# EAGLE design Rariot (EAGLE 6.5.0)
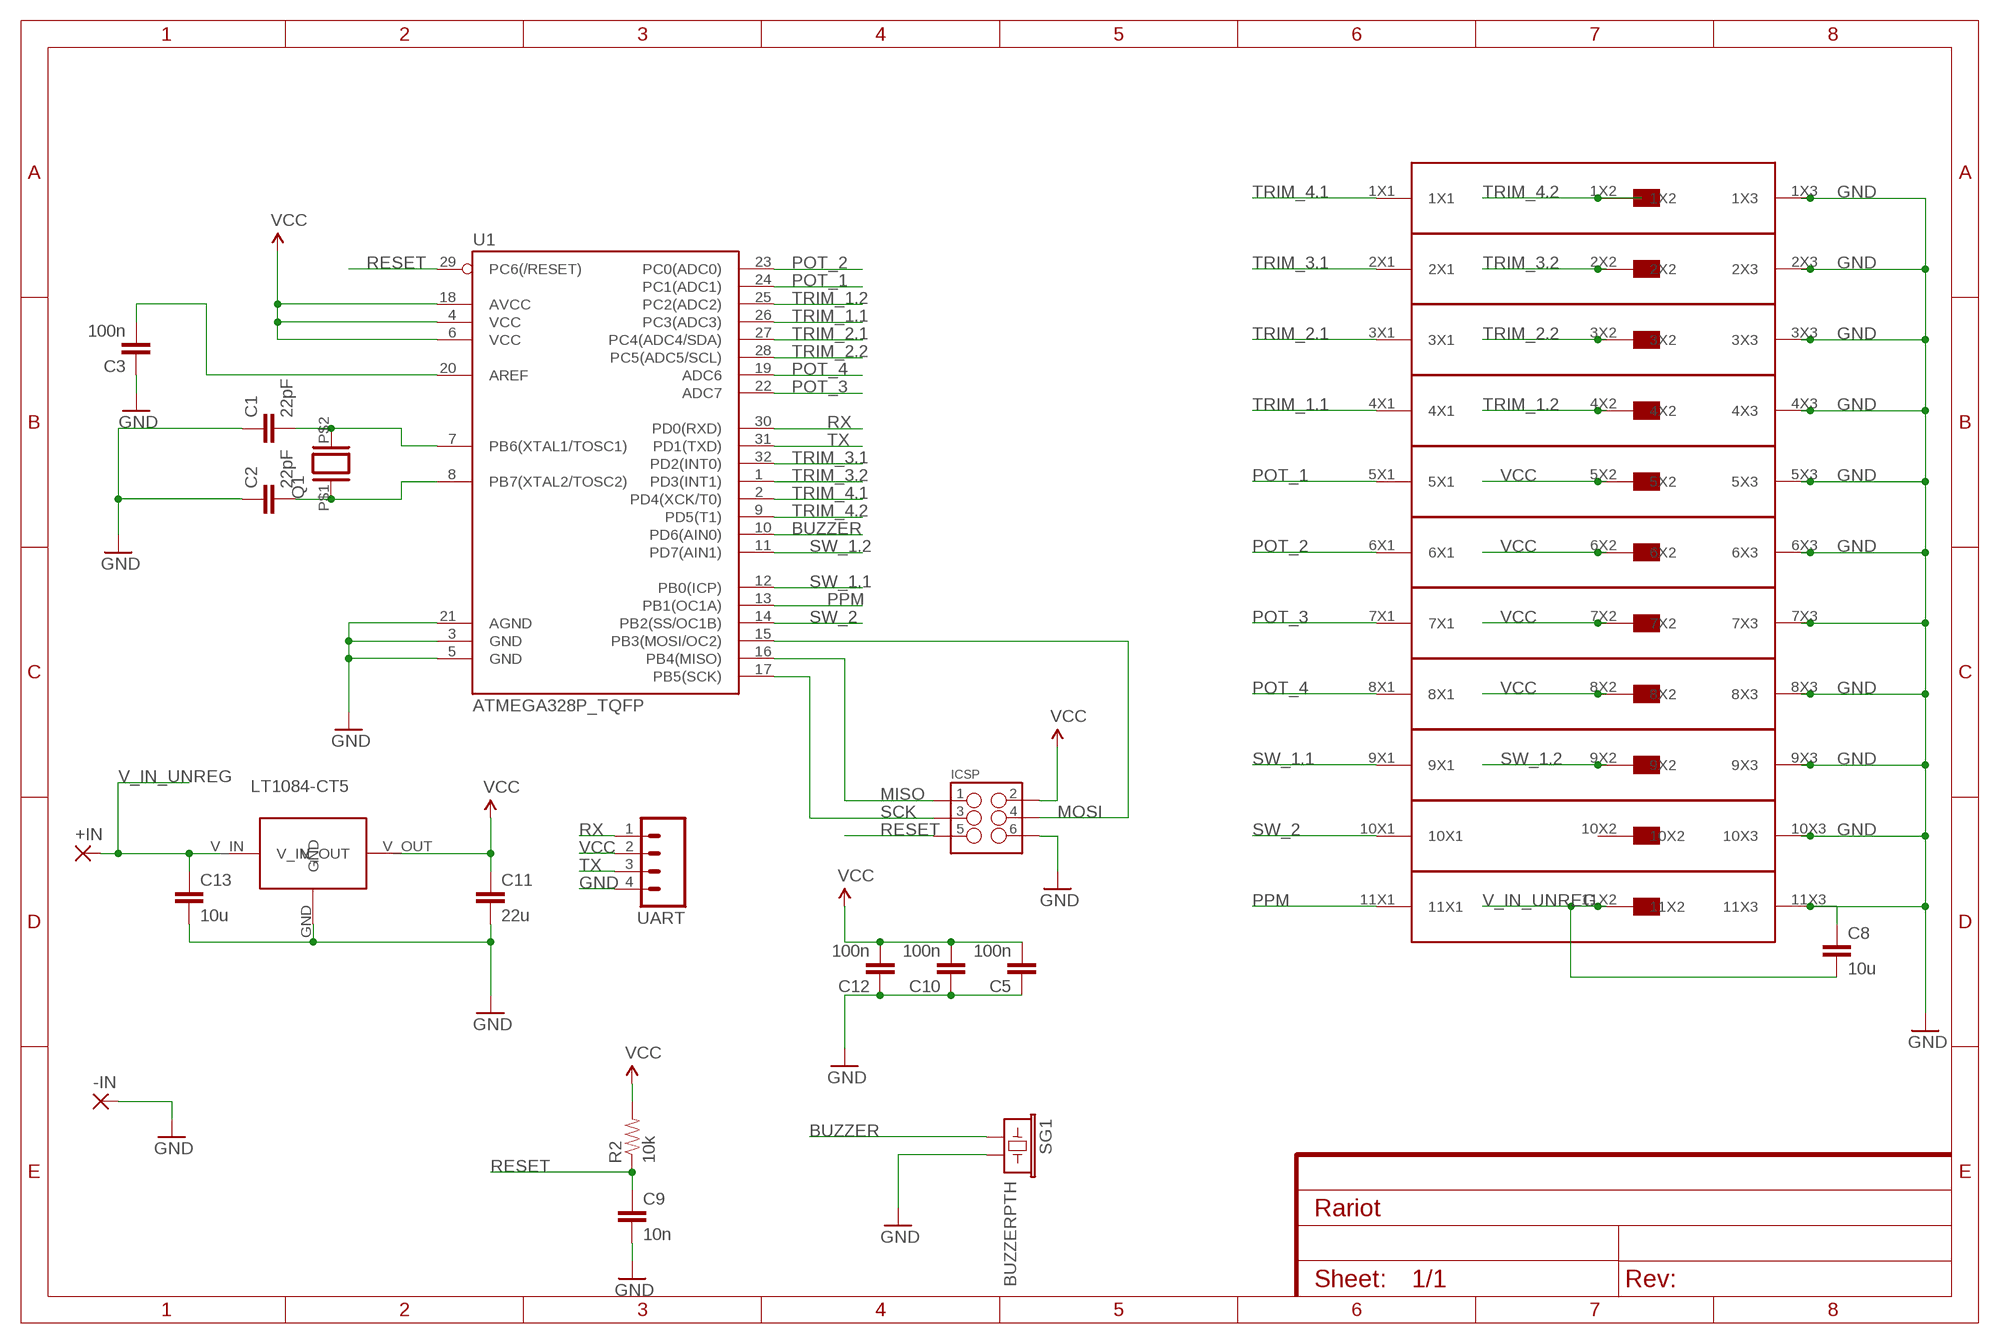
[diagram p0: schematic, sheet 1]

## Parts
+IN  SMD5  [SMD2,54-5,08]
-IN  SMD5  [SMD2,54-5,08]
C1  22pF  CAP0805  [0805]
C2  22pF  CAP0805  [0805]
C3  100n  CAP0805  [0805]
C5  100n  CAP0805  [0805]
C8  10u  CAP1206  [1206]
C9  10n  CAP0805  [0805]
C10  100n  CAP0805  [0805]
C11  22u  CAP1206  [1206]
C12  100n  CAP0805  [0805]
C13  10u  CAP1206  [1206]
ICSP  FEMALE 2x3  M03X2FEMALE  [2X3]
Q1  XTAL/SSMD  [X-TAL_SMD]
R2  10k  RESISTOR0805-RES  [0805]
SG1  BUZZERPTH  [BUZZER-12MM]
U1  ATMEGA328P_TQFP  [TQFP32-08]
U$1  11X3_2.54_PIN_HEADER  [11X3_2,54_PIN_HEADER]
U$2  LT1084-CT5  [TO-220]
UART  M04PTH  [1X04]

## Nets
BUZZER: SG1.+ U1.10(PD6(AIN0))
GND: -IN.1(P) C1.1 C2.1 C3.1 C5.1 C8.1 C9.2 C10.1 C11.2 C12.1 C13.2 ICSP.6 SG1.- U1.3(GND) U1.5(GND) U1.21(AGND) U$1.1X3 U$1.2X3 U$1.3X3 U$1.4X3 U$1.5X3 U$1.6X3 U$1.7X3 U$1.8X3 U$1.9X3 U$1.10X3 U$1.11X3 U$2.GND UART.4
MISO: ICSP.1 U1.16(PB4(MISO))
MOSI: ICSP.4 U1.15(PB3(MOSI/OC2))
N$2: C1.2 Q1.P$2 U1.7(PB6(XTAL1/TOSC1))
N$3: C3.2 U1.20(AREF)
N$4: C2.2 Q1.P$1 U1.8(PB7(XTAL2/TOSC2))
POT_1: U1.24(PC1(ADC1)) U$1.5X1
POT_2: U1.23(PC0(ADC0)) U$1.6X1
POT_3: U1.22(ADC7) U$1.7X1
POT_4: U1.19(ADC6) U$1.8X1
PPM: U1.13(PB1(OC1A)) U$1.11X1
RESET: C9.1 ICSP.5 R2.1 U1.29(PC6(/RESET))
RX: U1.30(PD0(RXD)) UART.1
SCK: ICSP.3 U1.17(PB5(SCK))
SW_1.1: U1.12(PB0(ICP)) U$1.9X1
SW_1.2: U1.11(PD7(AIN1)) U$1.9X2
SW_2: U1.14(PB2(SS/OC1B)) U$1.10X1
TRIM_1.1: U1.26(PC3(ADC3)) U$1.4X1
TRIM_1.2: U1.25(PC2(ADC2)) U$1.4X2
TRIM_2.1: U1.27(PC4(ADC4/SDA)) U$1.3X1
TRIM_2.2: U1.28(PC5(ADC5/SCL)) U$1.3X2
TRIM_3.1: U1.32(PD2(INT0)) U$1.2X1
TRIM_3.2: U1.1(PD3(INT1)) U$1.2X2
TRIM_4.1: U1.2(PD4(XCK/T0)) U$1.1X1
TRIM_4.2: U1.9(PD5(T1)) U$1.1X2
TX: U1.31(PD1(TXD)) UART.3
V_IN_UNREG: +IN.1(P) C8.2 C13.1 U$1.11X2 U$2.V_IN
VCC: C5.2 C10.2 C11.1 C12.2 ICSP.2 R2.2 U1.4(VCC) U1.6(VCC) U1.18(AVCC) U$1.5X2 U$1.6X2 U$1.7X2 U$1.8X2 U$2.V_OUT UART.2
Unconnected: U$1.10X2

## Library data of the parts
+IN -IN = wirepad:SMD5: SMD PAD
C1-C3 C5 C8-C13 = SparkFun-Capacitors:CAP: Capacitor Standard 0603 ceramic capacitor, and 0.1" leaded capacitor.
ICSP = SparkFun-Connectors:M03X2: 2x3 .1" header. Shrouded, with keying- CONN-10681 SMT- CONN-11415 Pogo pins- HW-11044; PROD_ID: CONN-11566
Q1 = Oma_kirjasto:XTAL/S: CRYSTAL
R2 = SparkFun-Resistors:RESISTOR: Resistor Basic schematic elements and footprints for 0603, 1206, and PTH resistors.
SG1 = SparkFun-Electromechanical:BUZZER: Buzzer 12mm Spark Fun Electronics SKU : Comp-Buzzer
U1 = SparkFun-DigitalIC:ATMEGA328P_TQFP; PROD_ID: IC-09069
U$1 = Oma_kirjasto:11X3_2.54_PIN_HEADER
U$2 = Oma_kirjasto:LT1084-CT5
UART = SparkFun-Connectors:M04: Header 4 Standard 4-pin 0.1" header. Use with straight break away headers (SKU : PRT-00116), right angle break away headers (PRT-00553), swiss pins (PRT-00743), machine pins (PRT-00117), and female headers (PRT-00115). Molex polarized connector foot print use with SKU : PRT-08231 with associated crimp pins and housings. 1MM SMD Version SKU: PRT-10208

## Net classes
0 default: width 0.457 mm, drill 0.406 mm, clearance 0.254 mm

## Board
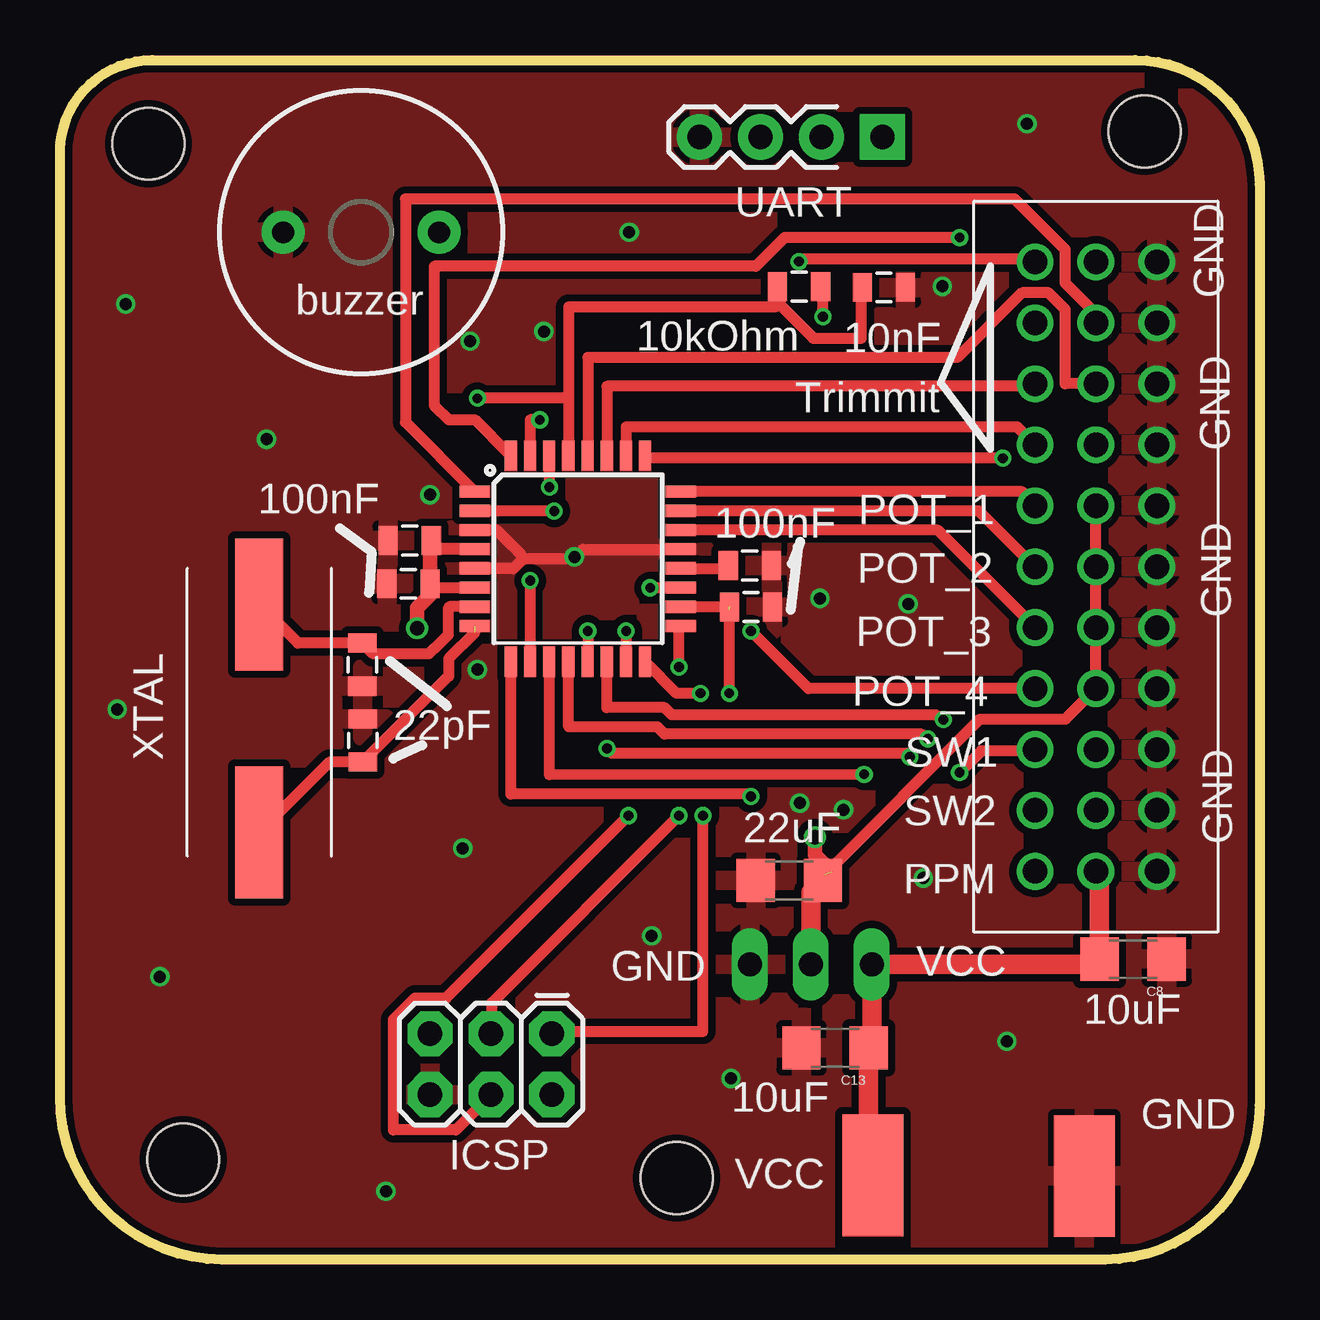
[diagram p1: board, top side]
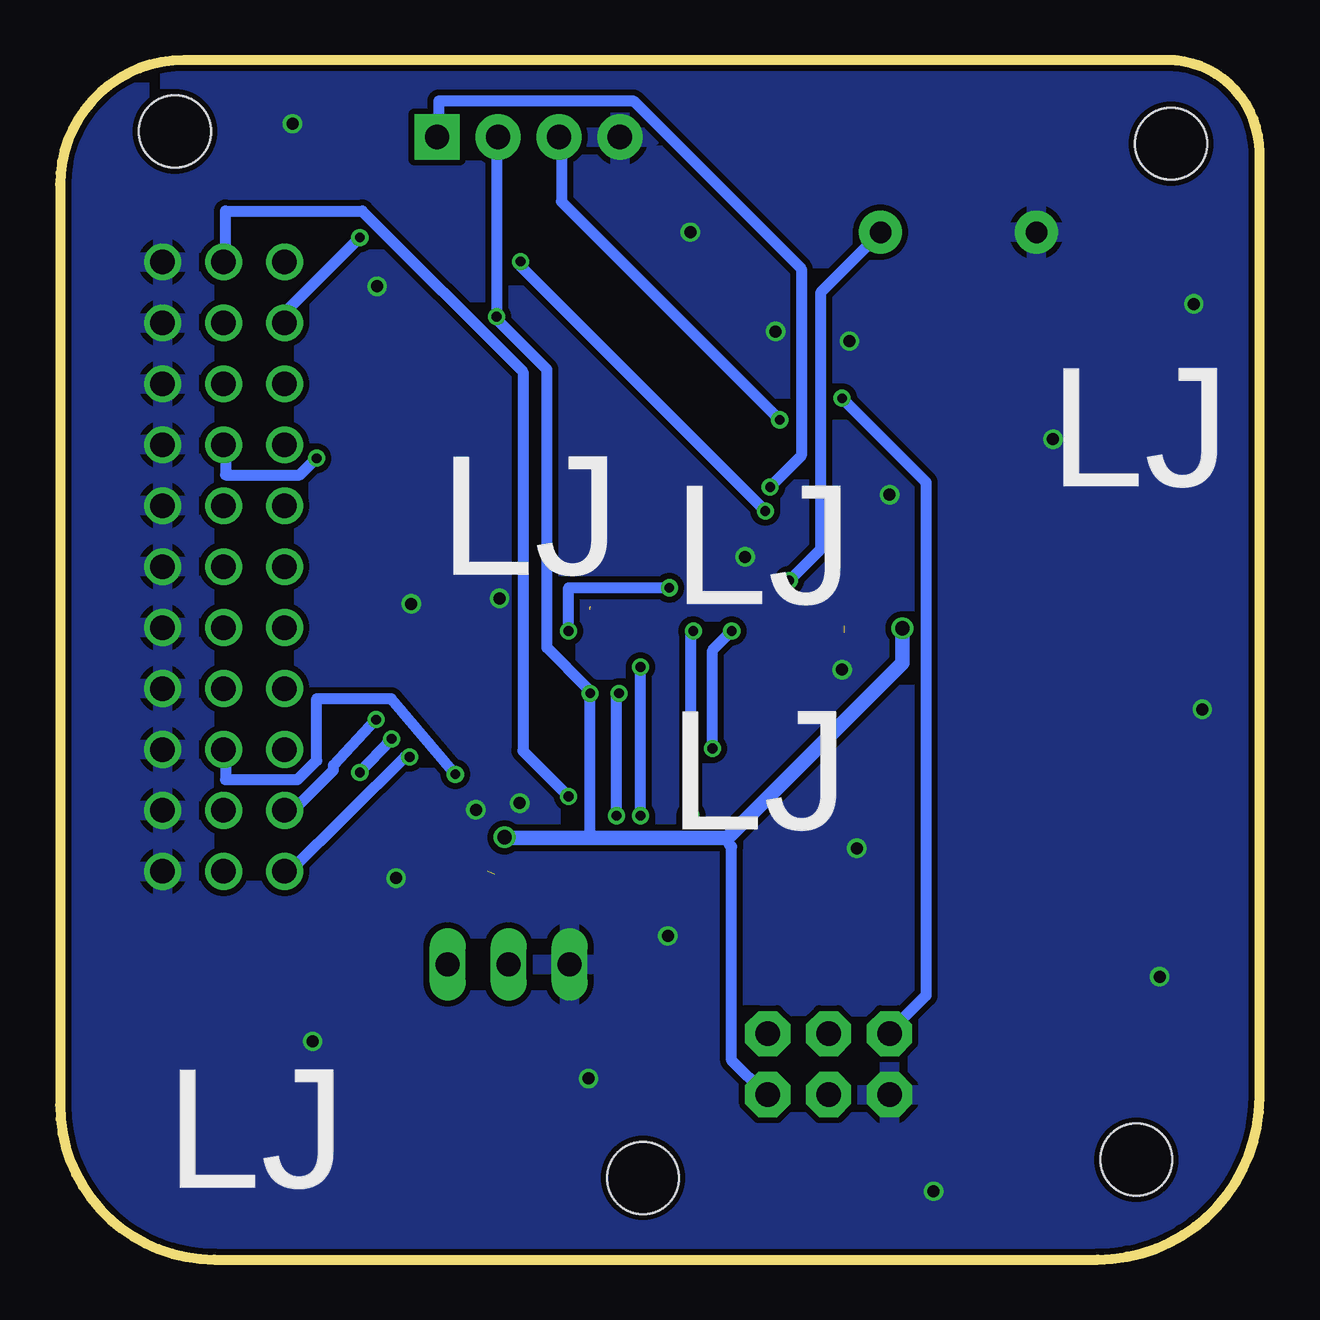
[diagram p2: board, bottom side, seen from below]

Size 50 x 50 mm. Coordinates in mm from the lower left corner, seen from the top.
Outline: 50,44.82 50,6.44 arc-90 43.56,0 6.76,0 arc-90 0,6.76 0,46.15 arc-90 3.85,50 44.82,50 arc-90 50,44.82
Copper layers (1*16): Top 0.035mm / dielectric 1.5mm / Bottom 0.035mm
Design rules "dirt_cheap_dirty_boards.v1": minimum track width 5mil, minimum drill 12mil, track to track 5mil, track to pad 5mil, pad to pad 5mil, via to via 5mil, smd to smd 0mil, copper to edge 10mil, drill to drill 10mil, minimum pad ring 10mil, minimum via ring 6mil, stop-mask expansion 2mil, vias tented up to drill 25mil, thermal gap 10mil
Holes 3 mm at 3.68,46.51 45.2,47.02 5.13,4.16 25.7,3.4

### Footprints (pad centres in the part's own frame; a part is rotated, then mirrored left to right if it is on the bottom)
SMD2,54-5,08 = smd 2.54 x 5.08: 1 0,0
0805 = smd 0.8 x 1.2: 1 -0.9,0; 2 0.9,0
1206 = smd 1.6 x 1.8: 1 -1.4,0; 2 1.4,0
2X3 = drill 1.016 pad 1.88 octagon: 1 0,0; 2 0,2.54; 3 2.54,0; 4 2.54,2.54; 5 5.08,0; 6 5.08,2.54
X-TAL_SMD = smd 5.5 x 2: P$1 0,0; P$2 9.5,0
BUZZER-12MM = drill 0.9 pad 1.778: + 3.25,0; - -3.25,0
TQFP32-08 = smd 1.27 x 0.508: 1 -4.293,2.8; 2 -4.293,2; 3 -4.293,1.2; 4 -4.293,0.4; 5 -4.293,-0.4; 6 -4.293,-1.2; 7 -4.293,-2; 8 -4.293,-2.8; 17 4.293,-2.8; 18 4.293,-2; 19 4.293,-1.2; 20 4.293,-0.4; 21 4.293,0.4; 22 4.293,1.2; 23 4.293,2; 24 4.293,2.8 | smd 0.508 x 1.27: 9 -2.8,-4.293; 10 -2,-4.293; 11 -1.2,-4.293; 12 -0.4,-4.293; 13 0.4,-4.293; 14 1.2,-4.293; 15 2,-4.293; 16 2.8,-4.293; 25 2.8,4.293; 26 2,4.293; 27 1.2,4.293; 28 0.4,4.293; 29 -0.4,4.293; 30 -1.2,4.293; 31 -2,4.293; 32 -2.8,4.293
11X3_2,54_PIN_HEADER = drill 1.02: 1X1 0,0; 1X2 2.54,0; 1X3 5.08,0; 2X1 0,-2.54; 2X2 2.54,-2.54; 2X3 5.08,-2.54; 3X1 0,-5.08; 3X2 2.54,-5.08; 3X3 5.08,-5.08; 4X1 0,-7.62; 4X2 2.54,-7.62; 4X3 5.08,-7.62; 5X1 0,-10.16; 5X2 2.54,-10.16; 5X3 5.08,-10.16; 6X1 0,-12.7; 6X2 2.54,-12.7; 6X3 5.08,-12.7; 7X1 0,-15.24; 7X2 2.54,-15.24; 7X3 5.08,-15.24; 8X1 0,-17.78; 8X2 2.54,-17.78; 8X3 5.08,-17.78; 9X1 0,-20.32; 9X2 2.54,-20.32; 9X3 5.08,-20.32; 10X1 0,-22.86; 10X2 2.54,-22.86; 10X3 5.08,-22.86; 11X1 0,-25.4; 11X2 2.54,-25.4; 11X3 5.08,-25.4
TO-220 = drill 1 long: GND -2.54,0; V_IN 2.54,0; V_OUT 0,0
1X04 = drill 1.016 pad 1.88 square: 1 0,0 | drill 1.016 pad 1.88: 2 2.54,0; 3 5.08,0; 4 7.62,0

### Placement (x,y rotation side)
+IN  33.89,3.51 0 top
-IN  42.7,3.48 0 top
C1  12.6,24.8 90 top
C2  12.62,21.64 270 top
C3  28.75,28.93 180 top
C5  14.58,29.97 0 top
C8  44.73,12.52 180 top
C9  34.34,40.52 0 top
C10  14.53,28.17 0 top
C11  30.4,15.8 180 top
C12  28.8,27.2 180 top
C13  32.31,8.82 180 top
ICSP  20.5,9.41 180 top
Q1  8.31,17.81 90 top
R2  30.81,40.55 0 top
SG1  12.55,42.82 0 top
U1  21.59,29.21 0 top
U$1  40.64,41.58 0 top
U$2  31.3,12.3 0 top
UART  34.28,46.79 180 top

### Tracks (layer width: path | path; a pad name or v marks a point on that pad's centre or on a via)
BUZZER  (via drill 0.41)
  Top 0.457: v19.6,28.3 19.6,25 U1.10
  Bottom 0.457: v19.6,28.3 18.3,29.6 18.3,40.3 15.8,42.8 SG1.+
GND  (via drill 0.5 pad 0.3)
  Top 0.457: 19.3,29.2 18.9,28.8 U1.5 | 19.3,29.2 21.4,29.2 v21.44,29.29 21.6,29.4 21.8,29.6 25.8,29.6 U1.21 | U1.3 18.2,30.4 19.2,29.4 19.3,29.2
  other vias: 2.74,39.83 4.17,11.79 13.59,2.84 31.67,27.56 39.47,9.09 36.78,40.56 23.72,42.82 35.99,15.9 24.66,13.49 16.79,17.14 2.39,22.94 8.61,34.19 20.17,38.68 17.09,38.28 27.97,7.54 15.42,31.88 17.4,24.59 40.31,47.35 30.84,19.02 32.66,18.75 35.36,27.33
  pour Top (isolate 0.305): 50,44.98 50,6.46 arc-90 43.54,0 6.82,0 arc-90 0,6.82 0,45.68 arc-90 4.32,50 44.98,50 arc-90
  pour Bottom: 50,45.07 50,6.4 arc-90 43.6,0 6.85,0 arc-90 0,6.85 0,46.26 arc-90 3.74,50 45.07,50 arc-90
MISO  (via drill 0.41)
  Top 0.457: v26.7,23.6 25.7,23.6 24.4,24.9 U1.16 | v26.8,18.5 26.8,9.5 20.6,9.5 ICSP.1
  Bottom 0.457: v26.7,23.6 26.8,23.5 v26.8,18.5
MOSI  (via drill 0.41)
  Top 0.457: v23.6,26.2 23.6,25 U1.15 | v23.7,18.5 16.1,10.9 14.8,10.9 13.9,10 13.9,5.4 16.5,5.4 17.9,6.8 ICSP.4
  Bottom 0.457: v23.6,26.2 23.7,26.1 v23.7,18.5
N$2
  Top 0.457: 12.88,25.43 C1.2 | C1.2 9.92,25.7 Q1.P$2 | U1.7 16.24,27.21 16.18,27.15 16.18,26.04 15.62,25.48 15.6,25.48 15.37,25.25 13.05,25.25 C1.2 | 12.82,25.48 C1.2
N$3
  Top 0.457: U1.20 27.73,28.81 C3.2
N$4  (1 unrouted)
  Top 0.457: 17.3,26.14 16.2,25.04 16.2,24.32 C2.2 11.23,20.74 Q1.P$1
POT_1
  Top 0.457: U1.24 25.9,32 40.1,32 40.6,31.5 U$1.5X1
POT_2
  Top 0.457: U1.23 25.9,31.2 38.3,31.2 40.6,28.9 U$1.6X1
POT_3
  Top 0.457: U1.22 25.9,30.4 36.6,30.4 40.6,26.4 U$1.7X1
POT_4  (via drill 0.41)
  Top 0.457: v24.6,28 25.8,28 U1.19 | v28.8,26.2 31.2,23.8 40.6,23.8 U$1.8X1
  Bottom 0.457: v24.6,28 28.8,28 v28.8,26.2
PPM  (via drill 0.41)
  Top 0.457: v22,26.2 22,25 U1.13 | v22.8,21.3 23,21.1 35.3,21.1 v35.42,20.95
  Bottom 0.457: v22,26.2 22.8,25.4 v22.8,21.3 | v35.42,20.95 35.62,20.95 40.4,16.2 40.6,16.2 U$1.11X1
RESET  (via drill 0.41)
  Top 0.457: 30,39.8 31.4,38.4 33.4,38.4 33.4,40.5 C9.1 | 30,39.8 30,40.5 R2.1 | 21.2,35.9 21.2,39.7 29.8,39.7 30,39.8 | 21.2,35.9 21.2,33.6 U1.29 | 21.2,35.9 v17.4,35.9
  Bottom 0.457: v17.4,35.9 13.9,32.4 13.9,11 15.4,9.5 ICSP.5
RX  (via drill 0.41)
  Top 0.457: v20.4,32.2 U1.30
  Bottom 0.457: v20.4,32.2 19.1,33.5 19.1,41.3 26.1,48.3 34.2,48.3 34.2,46.8 UART.1
SCK  (via drill 0.41)
  Top 0.457: v25.8,24.7 25.8,26.4 U1.17 | v25.8,18.5 18,10.7 18,9.5 ICSP.3
  Bottom 0.457: v25.8,18.5 v25.8,24.7
SW_1.1  (via drill 0.41)
  Top 0.457: v36.17,21.7 35.9,21.9 25.2,21.9 24.9,22.2 21.2,22.2 21.2,24.9 U1.12 | v37.5,20.3 38.4,21.2 40.6,21.2 U$1.9X1
  Bottom 0.457: v37.5,20.3 v36.17,21.7
SW_1.2  (via drill 0.41)
  Top 0.457: v33.52,20.23 20.4,20.2 20.4,24.9 U1.11
  Bottom 0.457: v33.52,20.23 36.19,23.38 39.3,23.38 39.3,20.8 40.1,20 43.1,20 43.1,21.2 U$1.9X2
SW_2  (via drill 0.41)
  Top 0.457: v36.82,22.5 36.5,22.7 25.5,22.7 25.2,23 22.8,23 22.8,24.9 U1.14
  Bottom 0.457: v36.82,22.5 38.6,20.6 38.6,20.4 40.2,18.8 40.6,18.8 U$1.10X1
TRIM_1.1
  Top 0.457: U1.26 23.6,33.6 23.6,34.7 39.9,34.7 40.6,34 U$1.4X1
TRIM_1.2  (via drill 0.41)
  Top 0.457: v39.3,33.4 24.5,33.4 U1.25
  Bottom 0.457: v39.3,33.4 40,32.7 43.1,32.7 43.1,33.9 U$1.4X2
TRIM_2.1
  Top 0.457: U1.27 22.8,33.6 22.8,36.4 40.6,36.4 U$1.3X1
TRIM_2.2
  Top 0.457: U1.28 22,33.6 22,37.6 37.4,37.6 40.1,40.3 41.2,40.3 41.9,39.6 41.9,36.5 43.1,36.5 U$1.3X2
TRIM_3.1  (via drill 0.41)
  Top 0.457: v37.5,42.6 30.2,42.6 29,41.4 15.6,41.4 15.6,35.6 16.2,35 17.3,35 18.7,33.6 U1.32
  Bottom 0.457: v37.5,42.6 40.6,39.5 40.6,39.1 U$1.2X1
TRIM_3.2
  Top 0.457: U1.1 17.2,32.1 14.4,34.9 14.4,44.2 39.8,44.2 41.9,42.1 41.9,40.7 43.1,39.5 43.1,39.1 U$1.2X2
TRIM_4.1  (via drill 0.41)
  Top 0.457: v20.6,31.2 U1.2 | v30.8,41.6 30.9,41.7 40.5,41.7 40.6,41.6 U$1.1X1
  Bottom 0.457: v20.6,31.2 30.8,41.4 v30.8,41.6
TRIM_4.2  (via drill 0.41)
  Top 0.457: v28.8,19.3 28.7,19.4 18.8,19.4 18.8,24.9 U1.9
  Bottom 0.457: v28.8,19.3 30.7,21.2 30.7,37 37.4,43.7 43.1,43.7 43.1,41.6 U$1.1X2
TX  (via drill 0.41)
  Top 0.457: v20,35 19.6,35 19.6,33.6 U1.31
  Bottom 0.457: v20,35 29.1,44.1 29.1,46.7 UART.3
V_IN_UNREG
  Top 0.813: U$1.11X2 43.33,16.03 C8.2 43.11,12.3 U$2.V_IN 33.84,8.96 C13.1 33.71,3.69 +IN.1
VCC  (via drill 0.41, 0.6)  (3 unrouted)
  Top 0.457: v31.8,39.3 31.8,40.5 R2.2 | U1.6 17.2,28 15.7,28 C10.2 | v27.9,23.6 27.9,27.1 | C11.1 31.8,15.82 31.88,15.82 31.88,16.05 38.35,22.53 41.91,22.53 U$1.8X2 U$1.7X2 U$1.6X2 U$1.5X2 | U1.18 C12.2
  Top 0.508: U1.4 15.84,29.61 C5.2
  Top 0.61: C5.2 15.48,29.61 15.43,29.61 C10.2 15.43,28.01 15.44,28.01 15.44,27.71 14.88,27.15 v14.88,26.31 | v31.47,17.6 31.47,16.87 32.17,16.17
  Top 0.813: U$2.V_OUT 31.3,15.3 C11.1
  Bottom 0.457: UART.2 31.8,46.7 v31.8,39.3 31.7,39.1 29.7,37.1 29.7,25.5 28,23.8 v27.9,23.6 27.9,17.58 | 22.17,17.58 22.1,17.3 22,17.2 22,8.3 20.6,6.9 ICSP.2
  Bottom 0.61: v14.88,26.31 14.88,24.87 22.17,17.58 27.9,17.58 31.45,17.58 v31.47,17.6

### Text on the board
tPlace: UART | GND | buzzer | 10kOhm | 10nF | Trimmit | GND | 100nF | POT_1 | 100nF | POT_2 | GND | POT_3 | POT_4 | 22pF | SW1 | SW2 | 22uF | GND | PPM | GND | VCC | 10uF | 10uF | GND | ICSP | VCC
bPlace: LJ | LJ | LJ | LJ | LJ